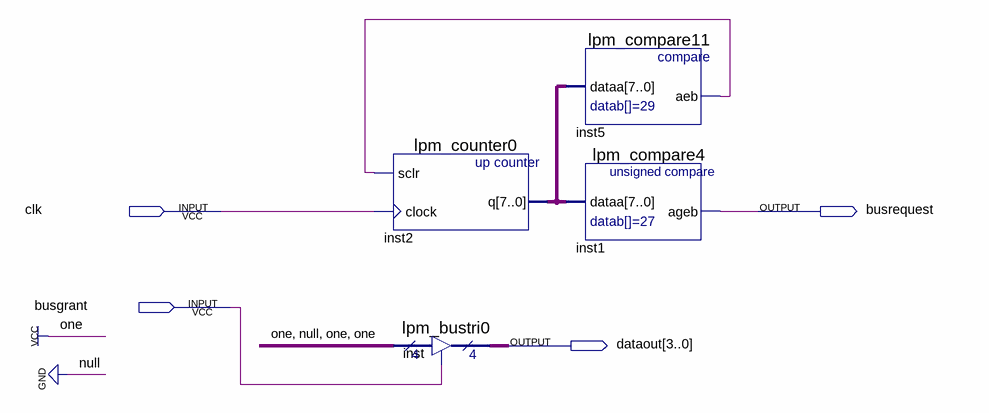
[diagram p0: schematic sheet]
// Quartus schematic lead_5.bdf as structural Verilog: 4 symbols, 4 pins
module lead_5 (
  input  clk,
  input  busgrant,
  output busrequest,
  output [3:0] dataout
);

  wire inst5_aeb;
  wire [7:0] inst2_q;

  lpm_counter0 inst2 (.sclr(inst5_aeb), .clock(clk), .q(inst2_q));
  lpm_bustri0 inst (.enabledt(busgrant), .data(4'b1011), .tridata(dataout));
  lpm_compare11 inst5 (.dataa(inst2_q), .aeb(inst5_aeb));
  lpm_compare4 inst1 (.dataa(inst2_q), .ageb(busrequest));
endmodule
